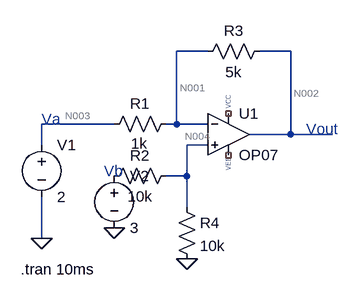
[diagram p0: schematic OPamp-07.asc]
OPamp-07.asc, the LTspice schematic file:
Version 4
SHEET 1 880 680
WIRE 192 32 144 32
WIRE 320 32 272 32
WIRE 48 144 -64 144
WIRE 144 144 144 32
WIRE 144 144 128 144
WIRE 192 144 144 144
WIRE 320 160 320 32
WIRE 320 160 256 160
WIRE 384 160 320 160
WIRE -64 176 -64 144
WIRE 192 176 160 176
WIRE 160 224 160 176
WIRE 160 224 128 224
WIRE 160 272 160 224
WIRE -64 320 -64 256
FLAG -64 320 0
FLAG 48 304 0
FLAG 160 352 0
SYMBOL OpAmps\\OP07 224 96 R0
SYMATTR InstName U1
SYMBOL res 144 128 R90
WINDOW 0 0 56 VBottom 2
WINDOW 3 30 57 VTop 2
SYMATTR InstName R1
SYMATTR Value 1k
SYMBOL res 144 208 R90
WINDOW 0 0 56 VBottom 2
WINDOW 3 32 56 VTop 2
SYMATTR InstName R2
SYMATTR Value 10k
SYMBOL voltage -64 160 R0
SYMATTR InstName V1
SYMATTR Value 2
SYMBOL voltage 48 208 R0
SYMATTR InstName V2
SYMATTR Value 3
SYMBOL res 288 16 R90
WINDOW 0 0 56 VBottom 2
WINDOW 3 32 56 VTop 2
SYMATTR InstName R3
SYMATTR Value 5k
SYMBOL res 144 256 R0
SYMATTR InstName R4
SYMATTR Value 10k
TEXT 224 120 VLeft 0 ;VCC
TEXT 224 216 VLeft 0 ;VEE
TEXT -64 136 Left 2 ;Va
TEXT 32 216 Left 2 ;Vb
TEXT 344 152 Left 2 ;Vout
TEXT -96 368 Left 2 !.tran 10ms

The netlist it stands for:
* OPamp-07.asc
XU1 N004 N001 NC_01 NC_02 N002 LT1001  ; OP07, pins In+ In- V+ V- OUT
R1 N001 N003 1k
R2 N004 P001 10k
V1 N003 0 2
V2 P001 0 3
R3 N002 N001 5k
R4 N004 0 10k
* VCC
* VEE
* Va
* Vb
* Vout
.tran 10ms
.lib LTC.lib
.backanno
.end

* Results of the author's LTspice run, read from the files saved beside the schematic
* Operating Point, zero values left out:
*   V(n001) = 2 V
*   V(n004) = 1.5 V
*   V(n002) = 2.001 V
*   V(n003) = 2 V
*   V(p001) = 3 V
*   I(R1) = 134.2 nA
*   I(R2) = -150 µA
*   I(R3) = 140.9 nA
*   I(R4) = 150 µA
*   I(V1) = 134.2 nA
*   I(V2) = -150 µA
*   Ix(u1:1) = -6.752 nA
*   Ix(u1:2) = 6.751 nA
*   Ix(u1:5) = -140.9 nA